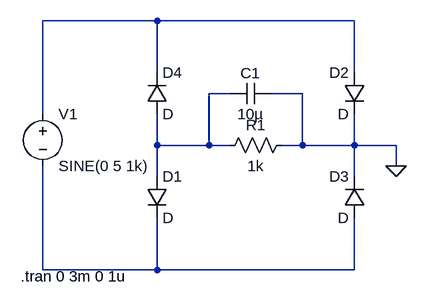
[diagram p0: schematic Rectificador de vuelta entera con capacitor.asc]
Rectificador de vuelta entera con capacitor.asc, the LTspice schematic file:
Version 4
SHEET 1 880 680
WIRE 112 -144 -64 -144
WIRE 416 -144 112 -144
WIRE 112 -64 112 -144
WIRE 416 -64 416 -144
WIRE 224 -32 192 -32
WIRE 336 -32 288 -32
WIRE -64 0 -64 -144
WIRE 112 48 112 0
WIRE 192 48 192 -32
WIRE 192 48 112 48
WIRE 224 48 192 48
WIRE 336 48 336 -32
WIRE 336 48 304 48
WIRE 416 48 416 0
WIRE 416 48 336 48
WIRE 480 48 416 48
WIRE 480 80 480 48
WIRE 112 96 112 48
WIRE 416 96 416 48
WIRE -64 240 -64 80
WIRE 112 240 112 160
WIRE 112 240 -64 240
WIRE 416 240 416 160
WIRE 416 240 112 240
FLAG 480 80 0
SYMBOL diode 96 96 R0
SYMATTR InstName D1
SYMBOL diode 432 -64 M0
SYMATTR InstName D2
SYMBOL diode 432 160 R180
WINDOW 0 24 64 Left 2
WINDOW 3 24 0 Left 2
SYMATTR InstName D3
SYMBOL diode 96 0 M180
WINDOW 0 24 64 Left 2
WINDOW 3 24 0 Left 2
SYMATTR InstName D4
SYMBOL voltage -64 -16 R0
WINDOW 123 0 0 Left 0
WINDOW 39 0 0 Left 0
SYMATTR InstName V1
SYMATTR Value SINE(0 5 1k)
SYMBOL res 320 32 R90
WINDOW 0 0 56 VBottom 2
WINDOW 3 32 56 VTop 2
SYMATTR InstName R1
SYMATTR Value 1k
SYMBOL cap 288 -48 R90
WINDOW 0 0 32 VBottom 2
WINDOW 3 32 32 VTop 2
SYMATTR InstName C1
SYMATTR Value 10µ
TEXT -98 250 Left 2 !.tran 0 3m 0 1u

The netlist it stands for:
* Rectificador de vuelta entera con capacitor.asc
D1 N002 N003 D
D2 N001 0 D
D3 N003 0 D
D4 N002 N001 D
V1 N001 N003 SINE(0 5 1k)
R1 0 N002 1k
C1 0 N002 10µ
.model D D
.lib standard.dio
.tran 0 3m 0 1u
.backanno
.end